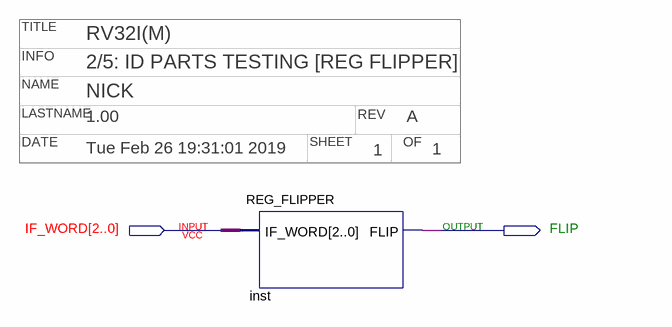
[diagram p0: schematic sheet]
// Quartus schematic REG_FLIPPERTEST.bdf as structural Verilog: 1 symbols, 2 pins
// Title block: TITLE: RV32I(M); INFO: 2/5: ID PARTS TESTING [REG FLIPPER]; NAME: NICK; LASTNAME: 1.00; REV: A; DATE: Tue Feb 26 19:31:01 2019; SHEET: 1; OF: 1
module REG_FLIPPERTEST (
  input  [2:0] IF_WORD,
  output FLIP
);

  REG_FLIPPER inst (.IF_WORD(IF_WORD), .FLIP(FLIP));
endmodule
